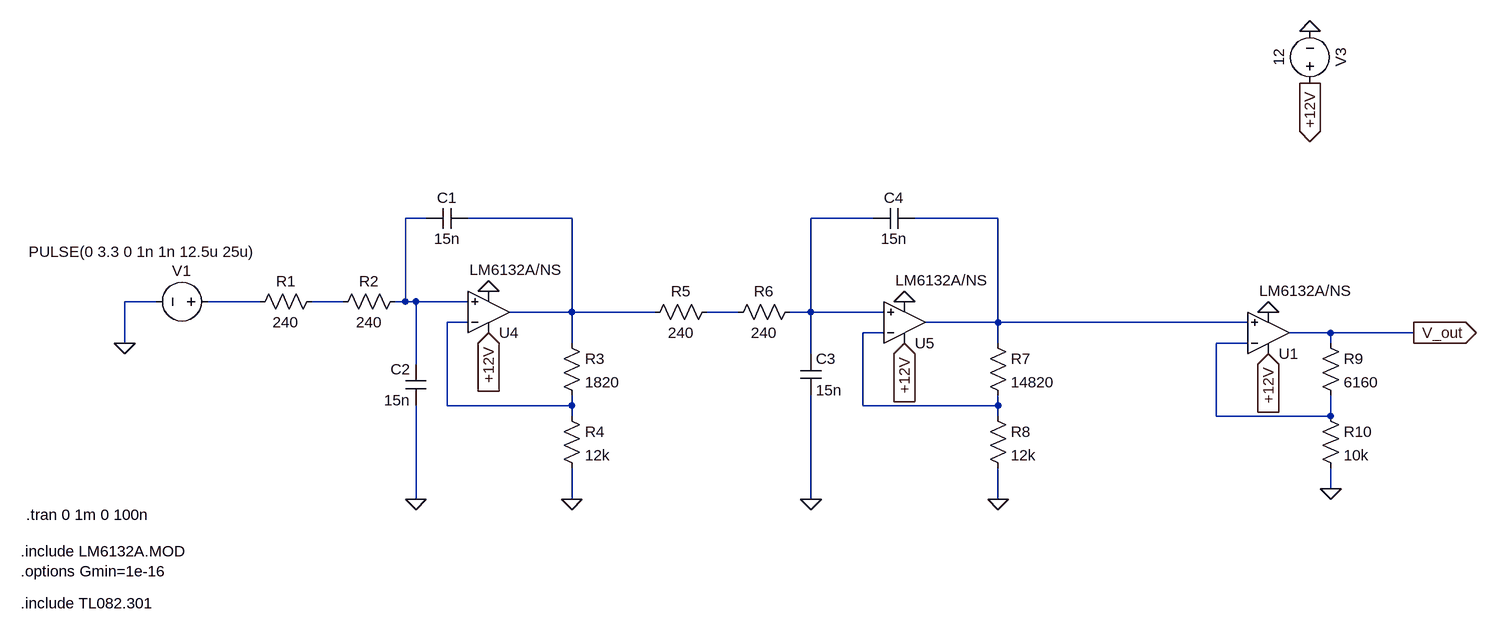
[diagram p0: schematic transmitter_circuit.asc]
transmitter_circuit.asc, the LTspice schematic file:
Version 4.1
SHEET 1 2448 680
WIRE 288 16 256 16
WIRE 512 16 352 16
WIRE 976 16 880 16
WIRE 1168 16 1040 16
WIRE -128 144 -176 144
WIRE 32 144 -48 144
WIRE 160 144 112 144
WIRE 256 144 256 16
WIRE 256 144 240 144
WIRE 272 144 256 144
WIRE 352 144 272 144
WIRE 512 160 512 16
WIRE 512 160 416 160
WIRE 640 160 512 160
WIRE 768 160 720 160
WIRE 880 160 880 16
WIRE 880 160 848 160
WIRE 992 160 880 160
WIRE 352 176 320 176
WIRE 1168 176 1168 16
WIRE 1168 176 1056 176
WIRE 1552 176 1168 176
WIRE 992 192 960 192
WIRE 1680 192 1616 192
WIRE 1808 192 1680 192
WIRE -176 208 -176 144
WIRE 512 208 512 160
WIRE 1168 208 1168 176
WIRE 1552 208 1504 208
WIRE 1680 208 1680 192
WIRE 880 224 880 160
WIRE 272 240 272 144
WIRE 320 304 320 176
WIRE 512 304 512 288
WIRE 512 304 320 304
WIRE 960 304 960 192
WIRE 1168 304 1168 288
WIRE 1168 304 960 304
WIRE 512 320 512 304
WIRE 1168 320 1168 304
WIRE 1504 320 1504 208
WIRE 1680 320 1680 288
WIRE 1680 320 1504 320
WIRE 1680 432 1680 400
WIRE 272 448 272 304
WIRE 512 448 512 400
WIRE 880 448 880 288
WIRE 1168 448 1168 400
FLAG -176 208 0
FLAG 272 448 0
FLAG 512 448 0
FLAG 1168 448 0
FLAG 880 448 0
FLAG 384 128 0
FLAG 1024 144 0
FLAG 384 192 +12V
IOPIN 384 192 In
FLAG 1024 208 +12V
IOPIN 1024 208 In
FLAG 1648 -272 0
FLAG 1808 192 V_out
IOPIN 1808 192 Out
FLAG 1648 -192 +12V
IOPIN 1648 -192 Out
FLAG 1680 432 0
FLAG 1584 224 +12V
IOPIN 1584 224 In
FLAG 1584 160 0
SYMBOL voltage -32 144 R90
WINDOW 0 -32 56 VBottom 2
WINDOW 3 -92 116 VTop 2
WINDOW 123 0 0 Left 0
WINDOW 39 0 0 Left 0
SYMATTR InstName V1
SYMATTR Value PULSE(0 3.3 0 1n 1n 12.5u 25u)
SYMBOL res 128 128 R90
WINDOW 0 0 56 VBottom 2
WINDOW 3 32 56 VTop 2
SYMATTR InstName R1
SYMATTR Value 240
SYMBOL res 256 128 R90
WINDOW 0 0 56 VBottom 2
WINDOW 3 32 56 VTop 2
SYMATTR InstName R2
SYMATTR Value 240
SYMBOL res 496 192 R0
SYMATTR InstName R3
SYMATTR Value 1820
SYMBOL res 496 304 R0
SYMATTR InstName R4
SYMATTR Value 12k
SYMBOL cap 352 0 R90
WINDOW 0 0 32 VBottom 2
WINDOW 3 32 32 VTop 2
SYMATTR InstName C1
SYMATTR Value 15n
SYMBOL cap 288 304 R180
WINDOW 0 24 56 Left 2
WINDOW 3 24 8 Left 2
SYMATTR InstName C2
SYMATTR Value 15n
SYMBOL res 736 144 R90
WINDOW 0 0 56 VBottom 2
WINDOW 3 32 56 VTop 2
SYMATTR InstName R5
SYMATTR Value 240
SYMBOL res 864 144 R90
WINDOW 0 0 56 VBottom 2
WINDOW 3 32 56 VTop 2
SYMATTR InstName R6
SYMATTR Value 240
SYMBOL cap 864 224 R0
SYMATTR InstName C3
SYMATTR Value 15n
SYMBOL cap 1040 0 R90
WINDOW 0 0 32 VBottom 2
WINDOW 3 32 32 VTop 2
SYMATTR InstName C4
SYMATTR Value 15n
SYMBOL res 1152 192 R0
SYMATTR InstName R7
SYMATTR Value 14820
SYMBOL res 1152 304 R0
SYMATTR InstName R8
SYMATTR Value 12k
SYMBOL OpAmps\\opamp2 384 224 M180
WINDOW 3 -29 129 Left 2
SYMATTR Value LM6132A/NS
SYMATTR InstName U4
SYMBOL OpAmps\\opamp2 1024 240 M180
WINDOW 3 -14 129 Left 2
SYMATTR Value LM6132A/NS
SYMATTR InstName U5
SYMBOL voltage 1648 -176 R180
WINDOW 0 -32 56 VBottom 2
WINDOW 3 32 56 VTop 2
WINDOW 123 0 0 Left 0
WINDOW 39 0 0 Left 0
SYMATTR InstName V3
SYMATTR Value 12
SYMBOL OpAmps\\opamp2 1584 256 M180
WINDOW 3 -14 129 Left 2
SYMATTR Value LM6132A/NS
SYMATTR InstName U1
SYMBOL res 1664 192 R0
SYMATTR InstName R9
SYMATTR Value 6160
SYMBOL res 1664 304 R0
SYMATTR InstName R10
SYMATTR Value 10k
TEXT -328 472 Left 2 !.tran 0 1m 0 100n
TEXT -336 528 Left 2 !.include LM6132A.MOD\n.options Gmin=1e-16
TEXT -336 608 Left 2 !.include TL082.301

The netlist it stands for:
* transmitter_circuit.asc
V1 N005 0 PULSE(0 3.3 0 1n 1n 12.5u 25u)
R1 N006 N005 240
R2 N001 N006 240
R3 N002 N008 1820
R4 N008 0 12k
C1 N002 N001 15n
C2 0 N001 15n
R5 N007 N002 240
R6 N003 N007 240
C3 N003 0 15n
C4 N004 N003 15n
R7 N004 N009 14820
R8 N009 0 12k
X§U4 N001 N008 +12V 0 N002 LM6132A/NS  ; pins In+ In- V+ V- OUT
X§U5 N003 N009 +12V 0 N004 LM6132A/NS  ; pins In+ In- V+ V- OUT
V3 +12V 0 12
X§U1 N004 N010 +12V 0 V_out LM6132A/NS  ; pins In+ In- V+ V- OUT
R9 V_out N010 6160
R10 N010 0 10k
.tran 0 1m 0 100n
.include LM6132A.MOD
.options Gmin=1e-16
.include TL082.301
.backanno
.end